# EAGLE design blahblahVCA.MB (EAGLE 9.6.2)
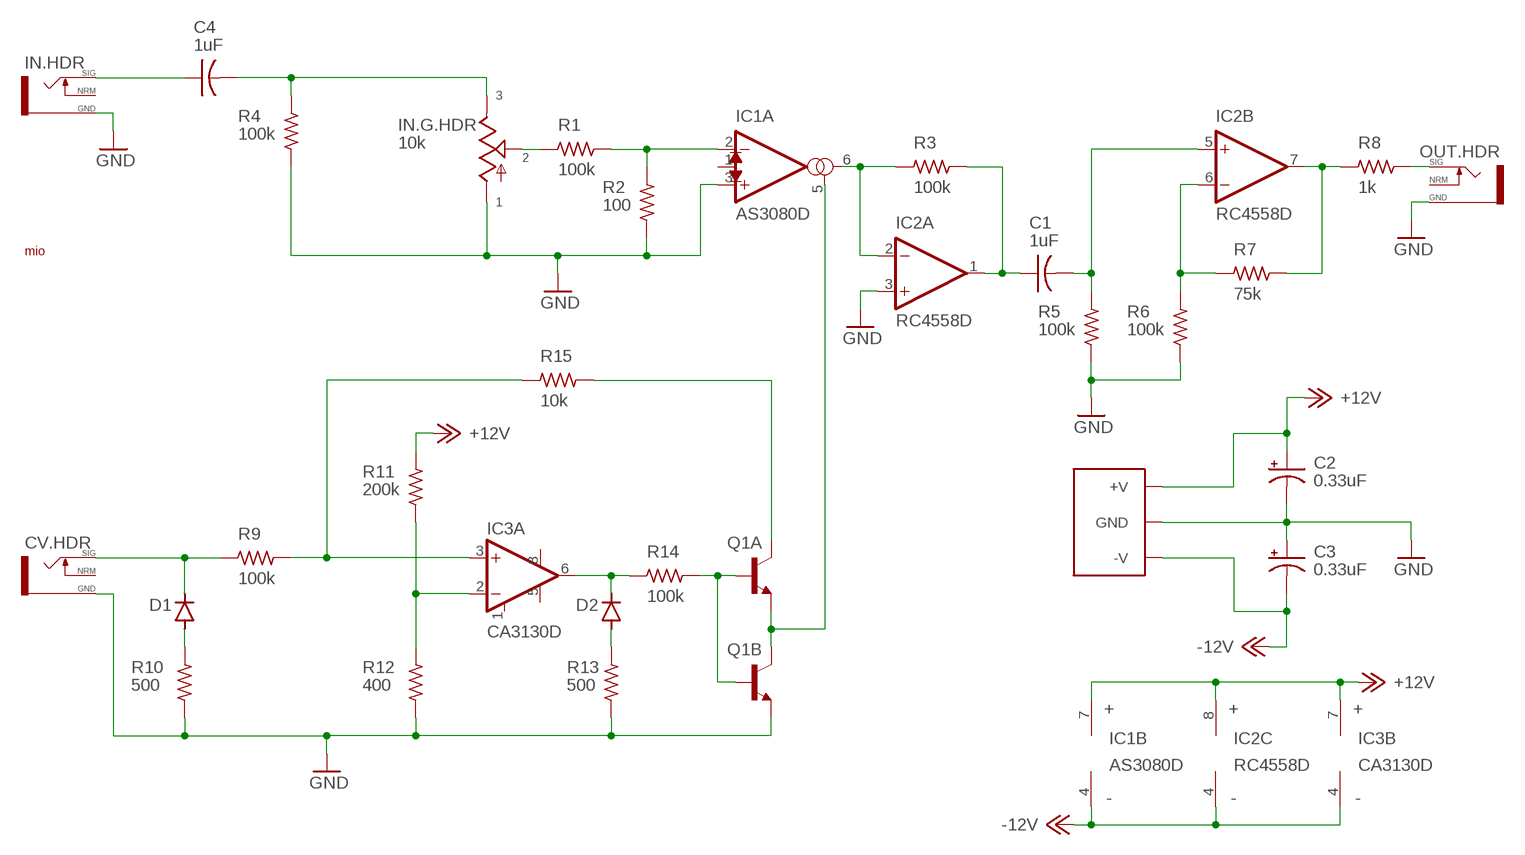
[diagram p0: schematic, sheet 1]

## Parts
C1  1uF  C-05  [C05]
C2  0.33uF  CPOL-E025  [E025]
C3  0.33uF  CPOL-E025  [E025]
C4  1uF  C-05  [C05]
CV.HDR  MONOHDR  [HEADER]
D1  D-123  [SOD-123]
D2  D-123  [SOD-123]
IC1  AS3080D  [DIL08]
IC2  RC4558D  [DIL08]
IC3  CA3130D  [DIL08]
IN.G.HDR  10k  PHDR  [HEADER]
IN.HDR  MONOHDR  [HEADER]
OUT.HDR  MONOHDR  [HEADER]
Q1  BCM847DS  [SOT-23-6]
R1  100k  R-1206  [R1206]
R2  100  R-1206  [R1206]
R3  100k  R-1206  [R1206]
R4  100k  R-1206  [R1206]
R5  100k  R-1206  [R1206]
R6  100k  R-1206  [R1206]
R7  75k  R-1206  [R1206]
R8  1k  R-1206  [R1206]
R9  100k  R-1206  [R1206]
R10  500  R-1206  [R1206]
R11  200k  R-1206  [R1206]
R12  400  R-1206  [R1206]
R13  500  R-1206  [R1206]
R14  100k  R-1206  [R1206]
R15  10k  R-1206  [R1206]
U$1  10PIN-PWR  [10PIN-HEADER]
U$2  MIO  [MIO]

## Nets
+12V: C2.+ IC1.7(B:V+) IC2.8(C:V+) IC3.7(B:V+) R11.2 U$1.9(+V) U$1.10(+V)
-12V: C3.- IC1.4(B:V-) IC2.4(C:V-) IC3.4(B:V-) U$1.1(-V) U$1.2(-V)
GND: C2.- C3.+ CV.HDR.GND(SLEEVE-GND) IC1.3(A:NON-INVERTING(+)) IC2.3(A:NON-INVERTING(+)) IN.G.HDR.1 IN.HDR.GND(SLEEVE-GND) OUT.HDR.GND(SLEEVE-GND) Q1.4(B:E) R2.1 R4.1 R5.1 R6.1 R10.1 R12.1 R13.1 U$1.3(GND) U$1.4(GND) U$1.5(GND) U$1.6(GND) U$1.7(GND) U$1.8(GND)
N$1: C4.1 IN.HDR.TIP-SIG
N$2: IC1.2(A:INVERTING(-)) R1.2 R2.2
N$3: C1.1 IC2.1(A:OUT) R3.2
N$4: IC1.6(A:OUT) IC2.2(A:INVERTING(-)) R3.1
N$5: IN.G.HDR.2 R1.1
N$6: C1.2 IC2.5(B:NON-INVERTING(+)) R5.2
N$7: IC2.6(B:INVERTING(-)) R6.2 R7.1
N$8: IC2.7(B:OUT) R7.2 R8.1
N$9: OUT.HDR.TIP-SIG R8.2
N$10: CV.HDR.TIP-SIG D1.C R9.1
N$11: IC3.3(A:NON-INVERTING(+)) R9.2 R15.1
N$12: D1.A R10.2
N$13: IC3.2(A:INVERTINGA(-)) R11.1 R12.2
N$14: D2.C IC3.6(A:OUT) R14.1
N$15: D2.A R13.2
N$16: Q1.2(A:B) Q1.5(B:B) R14.2
N$17: IC1.5(A:I-BIAS) Q1.1(A:E) Q1.3(B:C)
N$18: Q1.6(A:C) R15.2
N$20: C4.2 IN.G.HDR.3 R4.2
Unconnected: CV.HDR.NORM(SWITCH-NORM) IC1.1(A:D-BIAS) IC3.1(A:NULL(1)) IC3.5(A:NULL(5)) IC3.8(A:STRB) IN.HDR.NORM(SWITCH-NORM) OUT.HDR.NORM(SWITCH-NORM)

## Library data of the parts
C1 C4 = wb-rcl:C
C2 C3 = wb-rcl:CPOL
CV.HDR IN.HDR OUT.HDR = wb-jacks:MONO
D1 D2 = wb-diode:D
IC1 = wb-ota:AS3080: http://www.alfarzpp.lv/eng/sc/AS3080E.pdf
IC2 = wb-opamps:RC4558: Dual General-Purpose Operational Amplifier https://www.ti.com/lit/ds/symlink/rc4558.pdf
IC3 = wb-opamps:CA3130: BiMOS Op-Amp. Applications: • Sample-Hold Amplifiers • Long-Duration Timers/Monostables • High-Input-Impedance Comparators (Ideal Interface with Digital CMOS) • High-Input-Impedance Wideband Amplifiers https://www.renesas.com/us/en/document/dst/ca3130-ca3130a-datasheet
IN.G.HDR = wb-potswitch:P
Q1 = wb-transistors:BCM847DS
R1-R15 = wb-rcl:R
U$1 = wb-power:10PIN-PWR
U$2 = wb-art:MIO

## Board
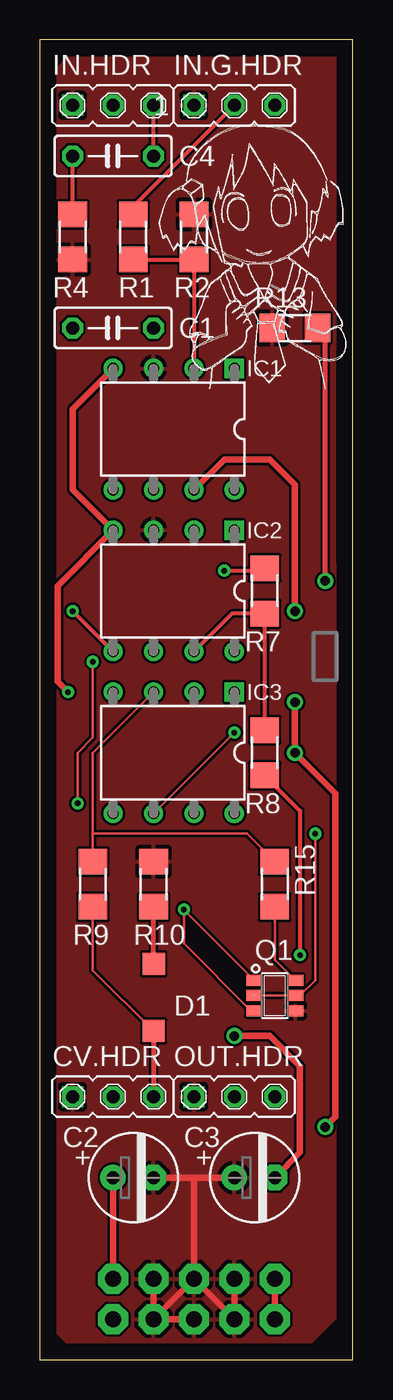
[diagram p1: board, top side]
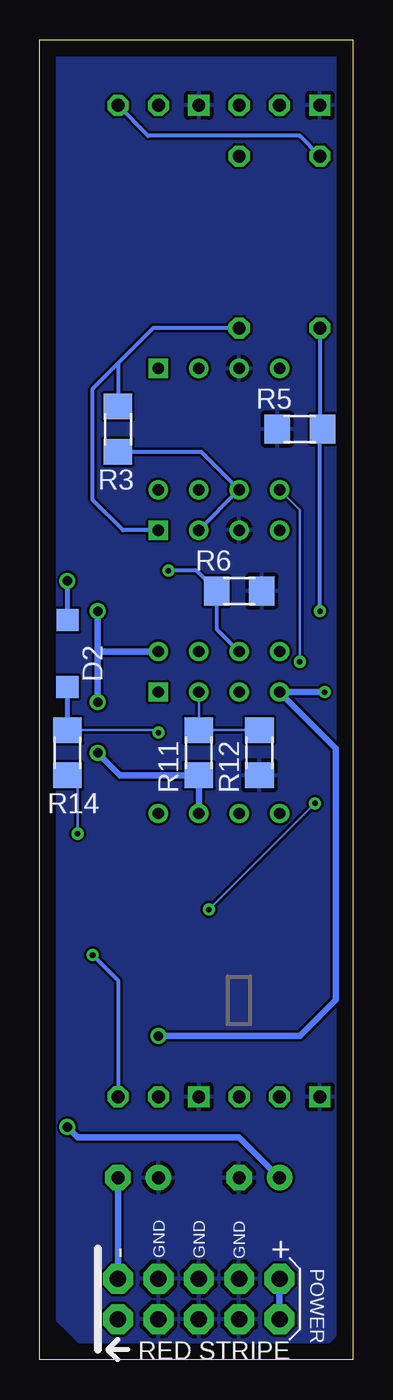
[diagram p2: board, bottom side, seen from below]

Size 19.67 x 82.86 mm. Coordinates in mm from the lower left corner, seen from the top.
Outline: 0,0 19.67,0 19.67,82.86 0,82.86 0,0
Copper layers (1*16): Top 0.035mm / dielectric 1.5mm / Bottom 0.035mm
Design rules "default": minimum track width 6mil, minimum drill 0.35mm, track to track 6mil, track to pad 6mil, pad to pad 6mil, via to via 6mil, smd to smd 6mil, copper to edge 40mil, drill to drill 6mil, minimum pad ring 10mil, minimum via ring 8mil, stop-mask expansion 4mil, vias tented up to drill 0mil, thermal gap 10mil

### Footprints (pad centres in the part's own frame; a part is rotated, then mirrored left to right if it is on the bottom)
C05 = drill 0.813 octagon: 1 -2.54,0; 2 2.54,0
E025 = drill 0.813 pad 1.6: + -1.27,0 | drill 0.813 pad 1.6 octagon: - 1.27,0
HEADER = drill 0.813 square: GND -2.54,0 | drill 0.813 octagon: NORM 0,0; TIP-SIG 2.54,0
SOD-123 = smd 1.4 x 1.4: A -1.984,0.013; C 2.223,0
DIL08 = drill 0.7 square: 1 -3.81,-3.81 | drill 0.7: 2 -1.27,-3.81; 3 1.27,-3.81; 4 3.81,-3.81; 5 3.81,3.81; 6 1.27,3.81; 7 -1.27,3.81; 8 -3.81,3.81
HEADER' = drill 0.813 square: 1 -2.54,0 | drill 0.813 octagon: 2 0,0; 3 2.54,0
SOT-23-6 = smd 0.69 x 0.99: 1 -0.95,-1.29; 2 0,-1.29; 3 0.95,-1.29; 4 0.95,1.3; 5 0,1.29; 6 -0.95,1.3
R1206 = smd 1.6 x 1.803: 1 -1.422,0; 2 1.422,0
10PIN-HEADER = drill 1.016 pad 1.88 octagon: 1 -5.08,-1.27; 2 -5.08,1.27; 3 -2.54,-1.27; 4 -2.54,1.27; 5 0,-1.27; 6 0,1.27; 7 2.54,-1.27; 8 2.54,1.27; 9 5.08,-1.27; 10 5.08,1.27

### Placement (x,y rotation side)
C1  4.6,64.77 180 top
C2  5.87,11.43 0 top
C3  13.49,11.43 0 top
C4  4.6,75.56 180 top
CV.HDR  4.6,16.51 0 top
D1  7.14,22.86 270 top
D2  17.94,44.45 270 bottom
IC1  8.41,58.42 180 top
IC2  8.41,48.26 180 top
IC3  8.41,38.1 180 top
IN.G.HDR  10k  [HEADER']  12.22,78.74 0 top
IN.HDR  4.6,78.74 0 top
OUT.HDR  12.22,16.51 0 top
Q1  14.76,22.86 270 top
R1  5.87,70.48 270 top
R2  9.68,70.48 270 top
R3  14.76,58.42 90 bottom
R4  2.06,70.48 90 top
R5  3.33,58.42 0 bottom
R6  7.14,48.26 180 bottom
R7  14.13,48.26 270 top
R8  14.13,38.1 270 top
R9  3.33,29.84 90 top
R10  7.14,29.84 270 top
R11  9.68,38.1 270 bottom
R12  5.87,38.1 90 bottom
R13  16.03,64.77 0 top
R14  17.94,38.1 270 bottom
R15  14.76,29.84 270 top
U$1  9.68,3.81 0 bottom
U$2  13.97,68.58 0 top

### Tracks (layer width: path | path; a pad name or v marks a point on that pad's centre or on a via)
+12V  (via drill 0.6, 0.6 pad 0.6)
  Top 0.406: IC1.7 11.59,56.52 14.45,56.52 16.03,54.93 v16.03,46.99 | v16.03,41.27 v16.03,38.1 18.57,35.56 18.57,15.24 v17.94,14.61 | U$1.10 C2.+
  Bottom 0.406: IC3.7 R11.2 14.61,36.68 v16.03,38.1 | v16.03,46.99 16.03,44.45 | 16.03,44.45 v16.03,41.27 | IC2.8 16.03,44.45 | U$1.9 U$1.10 | C2.+ 7.14,13.97 17.3,13.97 v17.94,14.61
-12V  (via drill 0.35 pad 0.6, 0.6 pad 0.6)
  Top 0.406: U$1.2 U$1.1 | IC1.4 2.06,59.69 2.06,54.61 IC2.4 1.11,48.58 1.11,42.57 v1.77,41.91 | v12.22,20.32 14.45,20.32 16.35,18.41 16.35,13.02 C3.-
  Bottom 0.406: C3.- U$1.2 | v12.22,20.32 3.33,20.32 1.06,22.59 1.06,38.37 IC3.4 v1.77,41.91
GND
  Top 0.406: U$1.4 U$1.3 U$1.6 | U$1.6 U$1.7 | U$1.8 U$1.7 | U$1.5 U$1.7 | C2.- 9.68,11.43 | 9.68,11.43 C3.+ | U$1.6 9.68,11.43
  pour Bottom: 1.11,82.07 18.57,82.07 19.37,81.28 19.37,3.17 17.14,0.95 1.59,0.95 0.32,2.22 0.32,28.89 0.48,29.05 0.48,81.44
  pour Top: 1.27,81.28 2.22,82.23 18.57,82.23 19.53,81.28 19.53,80.96 19.53,64.29 18.57,63.34 18.57,50.01 19.21,49.37 19.21,3.17 16.99,0.95 1.75,0.95 0.48,2.22 0.48,80.49
N$1
  Top 0.254: C4.1 IN.HDR.TIP-SIG
N$2
  Top 0.254: R1.2 R2.2 IC1.2
N$3
  Bottom 0.254: C1.1 12.54,64.77 14.76,62.55 | 14.76,62.55 R3.2 | IC2.1 14.45,52.07 16.35,53.98 16.35,60.96 14.76,62.55
N$4
  Bottom 0.254: R3.1 9.53,57 IC1.6 IC2.2
N$5
  Top 0.254: 6.03,71.91 R1.1 5.87,72.39 IN.G.HDR.2
N$6  (via drill 0.35 pad 0.6)
  Top 0.254: IC2.5 v2.06,46.99
  Bottom 0.254: C1.2 2.06,58.57 1.99,58.5 | 1.99,58.5 R5.2 | v2.06,46.99 2.06,58.42 1.99,58.5
N$7  (via drill 0.35 pad 0.6)
  Top 0.254: 13.65,49.68 R7.1 13.98,49.53 v11.59,49.53
  Bottom 0.254: v11.59,49.53 9.84,49.53 R6.2 8.57,45.87 IC2.6
N$8
  Top 0.254: IC2.7 12.07,46.84 R7.2 R8.1
N$9  (via drill 0.35 pad 0.6)
  Top 0.254: R8.2 16.35,34.46 v16.35,25.4
  Bottom 0.254: v16.35,25.4 14.76,23.81 OUT.HDR.TIP-SIG
N$10
  Top 0.152: R9.1 3.33,24.45 D1.C
  Top 0.305: D1.C CV.HDR.TIP-SIG
N$11
  Top 0.152: R9.2 3.33,33.02 | 3.33,33.02 3.33,38.1 IC3.3 | R15.1 13.01,33.02 3.33,33.02
N$12
  Top 0.305: D1.A 7.14,24.86 R10.2
N$13
  Bottom 0.152: IC3.2 R11.1 R12.2
N$14  (via drill 0.35)
  Top 0.152: IC3.6 v12.22,39.37
  Bottom 0.152: v12.22,39.37 12.38,39.52 R14.1
  Bottom 0.305: D2.C R14.1
N$15  (via drill 0.6)
  Top 0.305: v17.94,48.9 17.94,64.29 R13.2
  Bottom 0.305: D2.A 17.93,48.88 v17.94,48.9
N$16  (via drill 0.35 pad 0.6)
  Top 0.152: Q1.2 Q1.5 16.35,22.86 17.3,23.81 v17.3,33.02
  Bottom 0.152: v17.3,33.02 17.3,36.04 R14.2
N$17  (via drill 0.35)
  Top 0.152: 13.17,21.91 Q1.3 13.26,21.91 9.05,26.12 9.05,28.23 | Q1.1 9.05,28.23 | 9.05,28.23 v9.05,28.26 | v3.33,43.81 3.33,39.05 2.38,38.1 v2.38,34.92
  Bottom 0.152: v9.05,28.26 v2.38,34.92 | v3.33,43.81 3.33,53.34 IC1.5
N$18
  Top 0.152: Q1.6 14.76,25.11 R15.2
N$20
  Top 0.254: R4.2 C4.2
  Bottom 0.254: C4.2 3.33,76.83 12.86,76.83 IN.G.HDR.3